# EAGLE design Audio Connection and Filter (EAGLE 6.3)
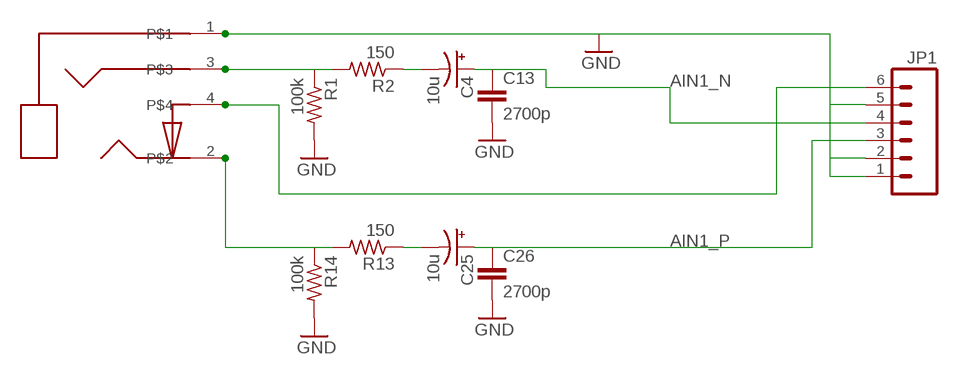
[diagram p0: schematic, sheet 1]

## Parts
C4  10u  CPOL-USB  [PANASONIC_B]
C13  2700p  CAP0402-CAP  [0402-CAP]
C25  10u  CPOL-USB  [PANASONIC_B]
C26  2700p  CAP0402-CAP  [0402-CAP]
J1  SJ1-3514-SMT  [SJ1-3514-SMT]
JP1  M06SMD  [1X06-SMD]
R1  100k  R-US_R0402  [R0402]
R2  150  R-US_R0402  [R0402]
R13  150  R-US_R0402  [R0402]
R14  100k  R-US_R0402  [R0402]

## Nets
AIN1_N: C4.+ C13.1 JP1.4
AIN1_P: C25.+ C26.1 JP1.3
CH1_IN: J1.4 JP1.6
GND: C13.2 C26.2 J1.1 JP1.1 JP1.2 JP1.5 R1.2 R14.2
N$1: J1.2 R13.2 R14.1
N$2: J1.3 R1.1 R2.2
N$3: C4.- R2.1
N$5: C25.- R13.1

## Library data of the parts
C4 C25 = adafruit:CPOL-US: POLARIZED CAPACITOR, American symbol
C13 C26 = SparkFun-Capacitors:CAP: Capacitor Standard 0603 ceramic capacitor, and 0.1" leaded capacitor.
J1 = Strutz Electronic Industries:SJ1-3514-SMT
JP1 = SparkFun-Connectors:M06: Header 6 Standard 6-pin 0.1" header. Use with straight break away headers (SKU : PRT-00116), right angle break away headers (PRT-00553), swiss pins (PRT-00743), machine pins (PRT-00117), and female headers (PRT-00115). Molex polarized connector foot print use with SKU : PRT-08094 with associated crimp pins and housings. NOTES ON THE VARIANTS LOCK and LOCK_LONGPADS... This footprint was designed to help hold the alignment of a through-hole component (i.e. 6-pin header) while soldering it into place. You may notice that each hole has been shifted either up or down by 0.005 of an inch from it's more standard position (which is a perfectly straight line). This slight alteration caused the pins (the squares in the middle) to touch the edges of the holes. Because they are alternating, it causes a "brace" to hold the component in place. 0.005 has proven to be the perfect amount of "off-center" position when using our standard breakaway headers. Although looks a little odd when you look at the bare footprint, once you have a header in there, the alteration is very hard to notice. Also,if you push a header all the way into place, it is covered up entirely on the bottom side. This idea of altering the position of holes to aid alignment will be further integrated into the Sparkfun Library for other footprints. It can help hold any component with 3 or more connection pins.
R1 R2 R13 R14 = adafruit:R-US_: RESISTOR, American symbol

## Board
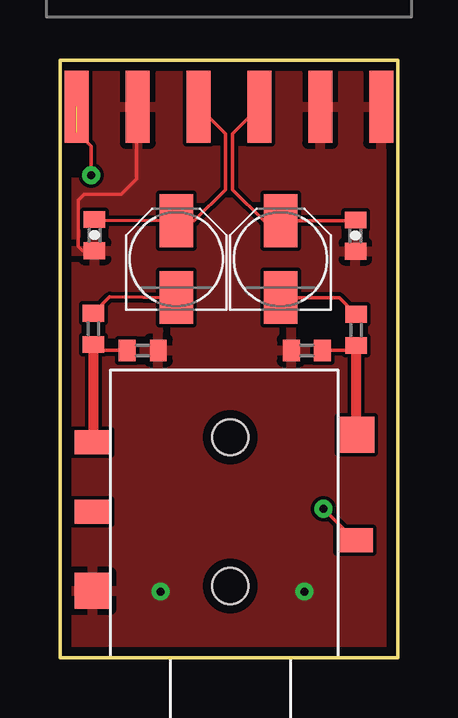
[diagram p1: board, top side]
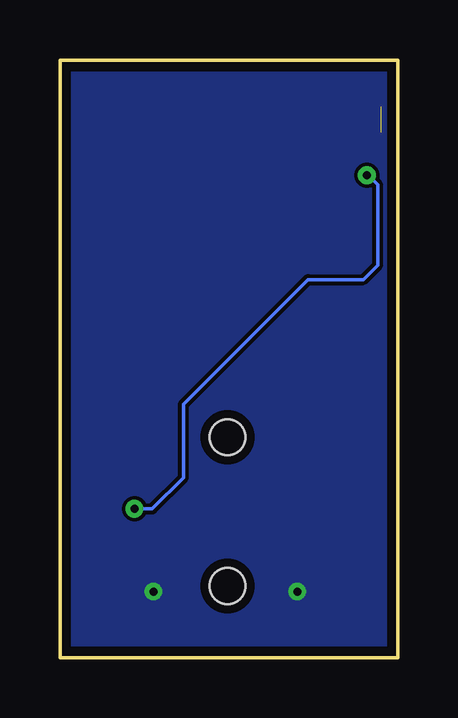
[diagram p2: board, bottom side, seen from below]

Size 14.1 x 24.9 mm. Coordinates in mm from the lower left corner, seen from the top.
Outline: 0,0 14.1,0 14.1,24.9 0,24.9 0,0
Copper layers (1*16): Top 0.035mm / dielectric 1.5mm / Bottom 0.035mm
Design rules "default *": minimum track width 6mil, minimum drill 13mil, track to track 6mil, track to pad 6mil, pad to pad 6mil, via to via 6mil, smd to smd 6mil, copper to edge 15mil, drill to drill 6mil, minimum pad ring 10mil, minimum via ring 8mil, stop-mask expansion 4mil, vias tented up to drill 0mil, thermal gap 10mil

### Footprints (pad centres in the part's own frame; a part is rotated, then mirrored left to right if it is on the bottom)
PANASONIC_B = smd 2.2 x 1.4: + 1.6,0; - -1.6,0
0402-CAP = smd 0.7 x 0.9: 1 -0.65,0; 2 0.65,0
SJ1-3514-SMT = smd 1.5 x 1.5: 1 -5.39,-2.97; 2 5.61,3.53 | smd 1.5 x 1: 3 -5.39,3.23; 4 5.56,-0.87; 5 -5.39,0.33 | hole 1.5: 0.36,-2.77; 0.36,3.43
1X06-SMD = smd 1 x 3: 1 -6.35,5; 2 -3.81,5; 3 -1.27,5; 4 1.27,5; 5 3.81,5; 6 6.35,5
R0402 = smd 0.7 x 0.9: 1 -0.65,0; 2 0.65,0

### Placement (x,y rotation side)
C4  4.85,16.6 90 top
C13  1.44,17.6 270 top
C25  9.2,16.6 90 top
C26  12.32,17.58 270 top
J1  6.75,5.75 0 top
JP1  7.05,27.95 180 top
R1  3.45,12.8 0 top
R2  1.4,13.7 270 top
R13  12.35,13.65 270 top
R14  10.3,12.8 180 top

### Tracks (layer width: path | path; a pad name or v marks a point on that pad's centre or on a via)
AIN1_N
  Top 0.152: C13.1 1.46,18.23 C4.+ 5.6,18.2 6.9,19.5 6.9,21.83 JP1.4
AIN1_P
  Top 0.152: C26.1 12.29,18.2 C25.+ 8.5,18.2 7.2,19.5 7.2,21.83 JP1.3
CH1_IN  (via drill 0.33)  (1 unrouted)
  Top 0.152: J1.4 v10.99,6.2 | v1.3,20.1 1.3,21.3 0.7,21.9
  Bottom 0.152: v1.3,20.1 1.25,20.1 0.85,19.7 0.85,16.35 1.45,15.75 3.75,15.75 8.95,10.55 8.95,7.5 10.25,6.2 v10.99,6.2
GND  (via drill 0.33)
  Top 0.152: C13.2 0.95,16.95 0.75,17.15 0.75,19.05 1,19.3 2.55,19.3 3.2,19.95 3.2,22.91 JP1.5
  other vias: 4.2,2.75 10.2,2.75
  pour Top: 0.05,0 14.1,-0.05 14.1,24.85 0.05,24.9
  pour Bottom: 0,0 14.1,0 14.1,24.9 0,24.9
N$1
  Top 0.152: R13.2 12.15,12.8 R14.1
  Top 0.406: J1.2 R13.2
N$2
  Top 0.152: R2.2 1.65,12.8 R1.1
  Top 0.406: J1.3 1.4,8.98 R2.2
N$3
  Top 0.152: R2.1 2.08,15.03 C4.-
N$5
  Top 0.152: R13.1 11.65,15 C25.-

### Text on the board
_tsilk: Shannon Strutz